# Altium schematic sheet E-Fuse.SchDoc: 12V Electronic Fuse
size A4; ApprovedBy: LD Stanton; Author: LD Stanton; CompanyName: University of Cape Town; DrawnBy: Lawrence Stanton; Engineer: Lawrence Stanton; Organization: University of Cape Town; Address1: Department of Electrical Engineering; Address2: Rondebosch; Address3: Cape Town; Address4: South Africa 7701; DocumentNumber: 8; SheetNumber: 8; SheetTotal: 20
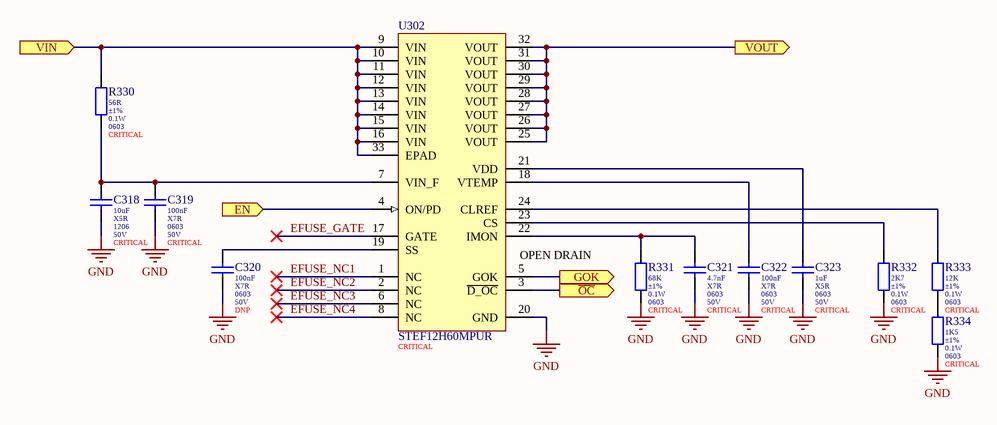
[diagram p0: E-Fuse.SchDoc]

## Parts
C318  value 10uF  Dielectric: X5R  Package: 1206  Voltage: 50V  Populate: CRITICAL  [1206_160_H (Samsumg) B]  (hidden comment: CL31A106KBHNNNE)
C319  value 100nF  Dielectric: X7R  Package: 0603  Voltage: 50V  Populate: CRITICAL  [0603 (Yageo DA) B]  (hidden comment: CC0603KRX7R9BB104)
C320  value 100nF  Dielectric: X7R  Package: 0603  Voltage: 50V  Populate: DNP  [0603 (Yageo DA) B]  (hidden comment: CC0603KRX7R9BB104)
C321  value 4.7nF  Dielectric: X7R  Package: 0603  Voltage: 50V  Populate: CRITICAL  [0603_080 (Guandong) B]  (hidden comment: 0603B472K500NT)
C322  value 100nF  Dielectric: X7R  Package: 0603  Voltage: 50V  Populate: CRITICAL  [0603 (Yageo DA) B]  (hidden comment: CC0603KRX7R9BB104)
C323  value 1uF  Dielectric: X5R  Package: 0603  Voltage: 50V  Populate: CRITICAL  [0603_080_8 (Samsung) B]  (hidden comment: CL10A105KB8NNNC)
R330  value 56R  Tolerance: ±1%  Power: 0.1W  Package: 0603  Populate: CRITICAL  [0603 (Uniroyal) B]  (hidden comment: 0603WAF5602T5E)
R331  value 68K  Tolerance: ±1%  Power: 0.1W  Package: 0603  Populate: CRITICAL  [0603 (Uniroyal) B]  (hidden comment: 0603WAF6802T5E)
R332  value 2K7  Tolerance: ±1%  Power: 0.1W  Package: 0603  Populate: CRITICAL  [0603 (Uniroyal) B]  (hidden comment: 0603WAF2701T5E)
R333  value 12K  Tolerance: ±1%  Power: 0.1W  Package: 0603  Populate: CRITICAL  [0603 (Uniroyal) B]  (hidden comment: 0603WAF1202T5E)
R334  value 1K5  Tolerance: ±1%  Power: 0.1W  Package: 0603  Populate: CRITICAL  [0603 (Uniroyal) B]  (hidden comment: 0603WAF1501T5E)
U302  STEF12H60MPUR  Placement: CRITICAL  [QFN32 (STEF12H60) B]

## Ports
EN (in), GOK (out), VIN (in), VOUT (out), ~{OC} (out)

## Nets
GND: C318.2 C319.2 C320.2 C321.2 C322.2 C323.2 R331.2 R332.2 R334.2 U302.20(GND)
~{OC}: U302.3(~{D_OC}) ; port ~{OC}
EFUSE_GATE: U302.17(GATE)
EFUSE_NC1: U302.1(NC)
EFUSE_NC2: U302.2(NC)
EFUSE_NC3: U302.6(NC)
EFUSE_NC4: U302.8(NC)
EN: U302.4(ON/PD) ; port EN
GOK: U302.5(GOK) ; port GOK
VIN: R330.1 U302.9(VIN) U302.10(VIN) U302.11(VIN) U302.12(VIN) U302.13(VIN) U302.14(VIN) U302.15(VIN) U302.16(VIN) U302.33(EPAD) ; port VIN
VOUT: U302.25(VOUT) U302.26(VOUT) U302.27(VOUT) U302.28(VOUT) U302.29(VOUT) U302.30(VOUT) U302.31(VOUT) U302.32(VOUT) ; port VOUT
NetC318_1: C318.1 C319.1 R330.2 U302.7(VIN_F)
NetC320_1: C320.1 U302.19(SS)
NetC321_1: C321.1 R331.1 U302.22(IMON)
NetC322_1: C322.1 U302.18(VTEMP)
NetC323_1: C323.1 U302.21(VDD)
NetR332_1: R332.1 U302.23(CS)
NetR333_1: R333.1 U302.24(CLREF)
NetR333_2: R333.2 R334.1

## Notes on the sheet
- (near U302) OPEN DRAIN
- Size:
- Date:
- A4
- Number:
- Time:
- Revision:
- Sheet
- of
- File:
- Author:

## Library data of the parts
C318 = CMP-045-000010-7: MLCC 10uF 1206 50V X5R ±10%; Manufacturer: Samsung; LCSC Part Number: C13585; ComponentLink1URL: https://datasheet.lcsc.com/szlcsc/Samsung-Electro-Mechanics-CL05C100JB5NNNC_C32949.pdf; Tolerance: ±10%; ComponentLink1Description: Datasheet
C319 C320 C322 = CMP-047-000000-7: MLCC 100nF 50V 0603 X7R ±10%; Manufacturer: Yageo; LCSC Part Number: C14663; Tolerance: ±10%; ComponentLink1URL: https://datasheet.lcsc.com/szlcsc/YAGEO-CC0603KRX7R9BB104_C14663.pdf; ComponentLink1Description: Datasheet
C321 = CMP-014-000016-1: MLCC 4.7nF 0603 50V X7R ±10%; Manufacturer: Guandong; Tolerance: ±15%; ComponentLink1URL: https://datasheet.lcsc.com/szlcsc/Guangdong-Fenghua-Advanced-Tech-0402B102K500NT_C1523.pdf; ComponentLink1Description: Datasheet; LCSC Part Number: C53987
C323 = CMP-045-000002-9: MLCC 1uF 0603 50V X5R ±10%; Manufacturer: Samsung; Tolerance: ±10%; ComponentLink1URL: https://datasheet.lcsc.com/szlcsc/Samsung-Electro-Mechanics-CL05C100JB5NNNC_C32949.pdf; ComponentLink1Description: Datasheet; LCSC Part Number: C15849
R330 = CMP-010-000341-10: Resistor 56R 0603 ±1% Thick Film Uniroyal; Temperature Coefficient: ±200ppm/K; Working Voltage: 75V; Manufacturer: Uniroyal; ComponentLink1Description: Datasheet; LCSC Part Number: C25196; Temperature: -55 - 155°C; ComponentLink1URL: https://datasheet.lcsc.com/szlcsc/1811062009_UNI-ROYAL-Uniroyal-Elec-0603WAF1002T5E_C25804.pdf; Pin Count: 2
R331 = CMP-010-000350-9: Resistor 68K 0603 ±1% Thick Film Uniroyal; Working Voltage: 75V; Temperature Coefficient: ±100ppm/K; Manufacturer: Uniroyal; ComponentLink1Description: Datasheet; Temperature: -55 - 155°C; ComponentLink1URL: https://datasheet.lcsc.com/szlcsc/1811062009_UNI-ROYAL-Uniroyal-Elec-0603WAF1002T5E_C25804.pdf; Pin Count: 2; LCSC Part Number: C23231
R332 = CMP-010-000326-9: Resistor 2K7 0603 ±1% Thick Film Uniroyal; Temperature Coefficient: ±100ppm/K; Working Voltage: 75V; ComponentLink1Description: Datasheet; LCSC Part Number: C13167; ComponentLink1URL: https://datasheet.lcsc.com/szlcsc/1811062009_UNI-ROYAL-Uniroyal-Elec-0603WAF1002T5E_C25804.pdf; Temperature: -55 - 155°C; Manufacturer: Uniroyal; Pin Count: 2
R333 = CMP-010-000351-11: Resistor 12K 0603 ±1% Thick Film Uniroyal; Working Voltage: 75V; Temperature Coefficient: ±100ppm/K; ComponentLink1URL: https://datasheet.lcsc.com/szlcsc/1811062009_UNI-ROYAL-Uniroyal-Elec-0603WAF1002T5E_C25804.pdf; ComponentLink1Description: Datasheet; LCSC Part Number: C22790; Pin Count: 2; Manufacturer: Uniroyal; Temperature: -55 - 155°C
R334 = CMP-010-000403-2: Resistor 1K5 0603 ±1% Thick Film Uniroyal; Temperature Coefficient: ±100ppm/K; Working Voltage: 75V; Temperature: -55 - 155°C; Manufacturer: Uniroyal; Pin Count: 2; ComponentLink1Description: Datasheet; LCSC Part Number: C22843; ComponentLink1URL: https://datasheet.lcsc.com/szlcsc/1811062009_UNI-ROYAL-Uniroyal-Elec-0603WAF1002T5E_C25804.pdf
U302 = CMP-000041-4: Electronic Fuse 60A 8-15V QFN32 ST; Manufacturer: ST Microelectronics; ComponentLink1Description: Datasheet; ComponentLink1URL: https://www.st.com/resource/en/datasheet/stef12h60m.pdf